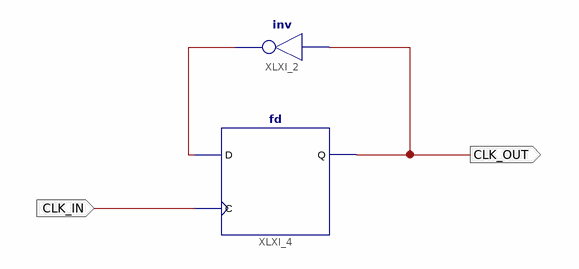
[diagram p0: schematic sheet 1]
// Xilinx ISE schematic divide2.sch (spartan6) as structural Verilog: 2 symbols, 2 ports
module divide2 (
  input  CLK_IN,
  output CLK_OUT
);

  wire XLXN_2;

  not XLXI_2 (XLXN_2, CLK_OUT);
  fd XLXI_4 (.C(CLK_IN), .D(XLXN_2), .Q(CLK_OUT));
endmodule
